# EAGLE schematic Clock (EAGLE 9.6.1)
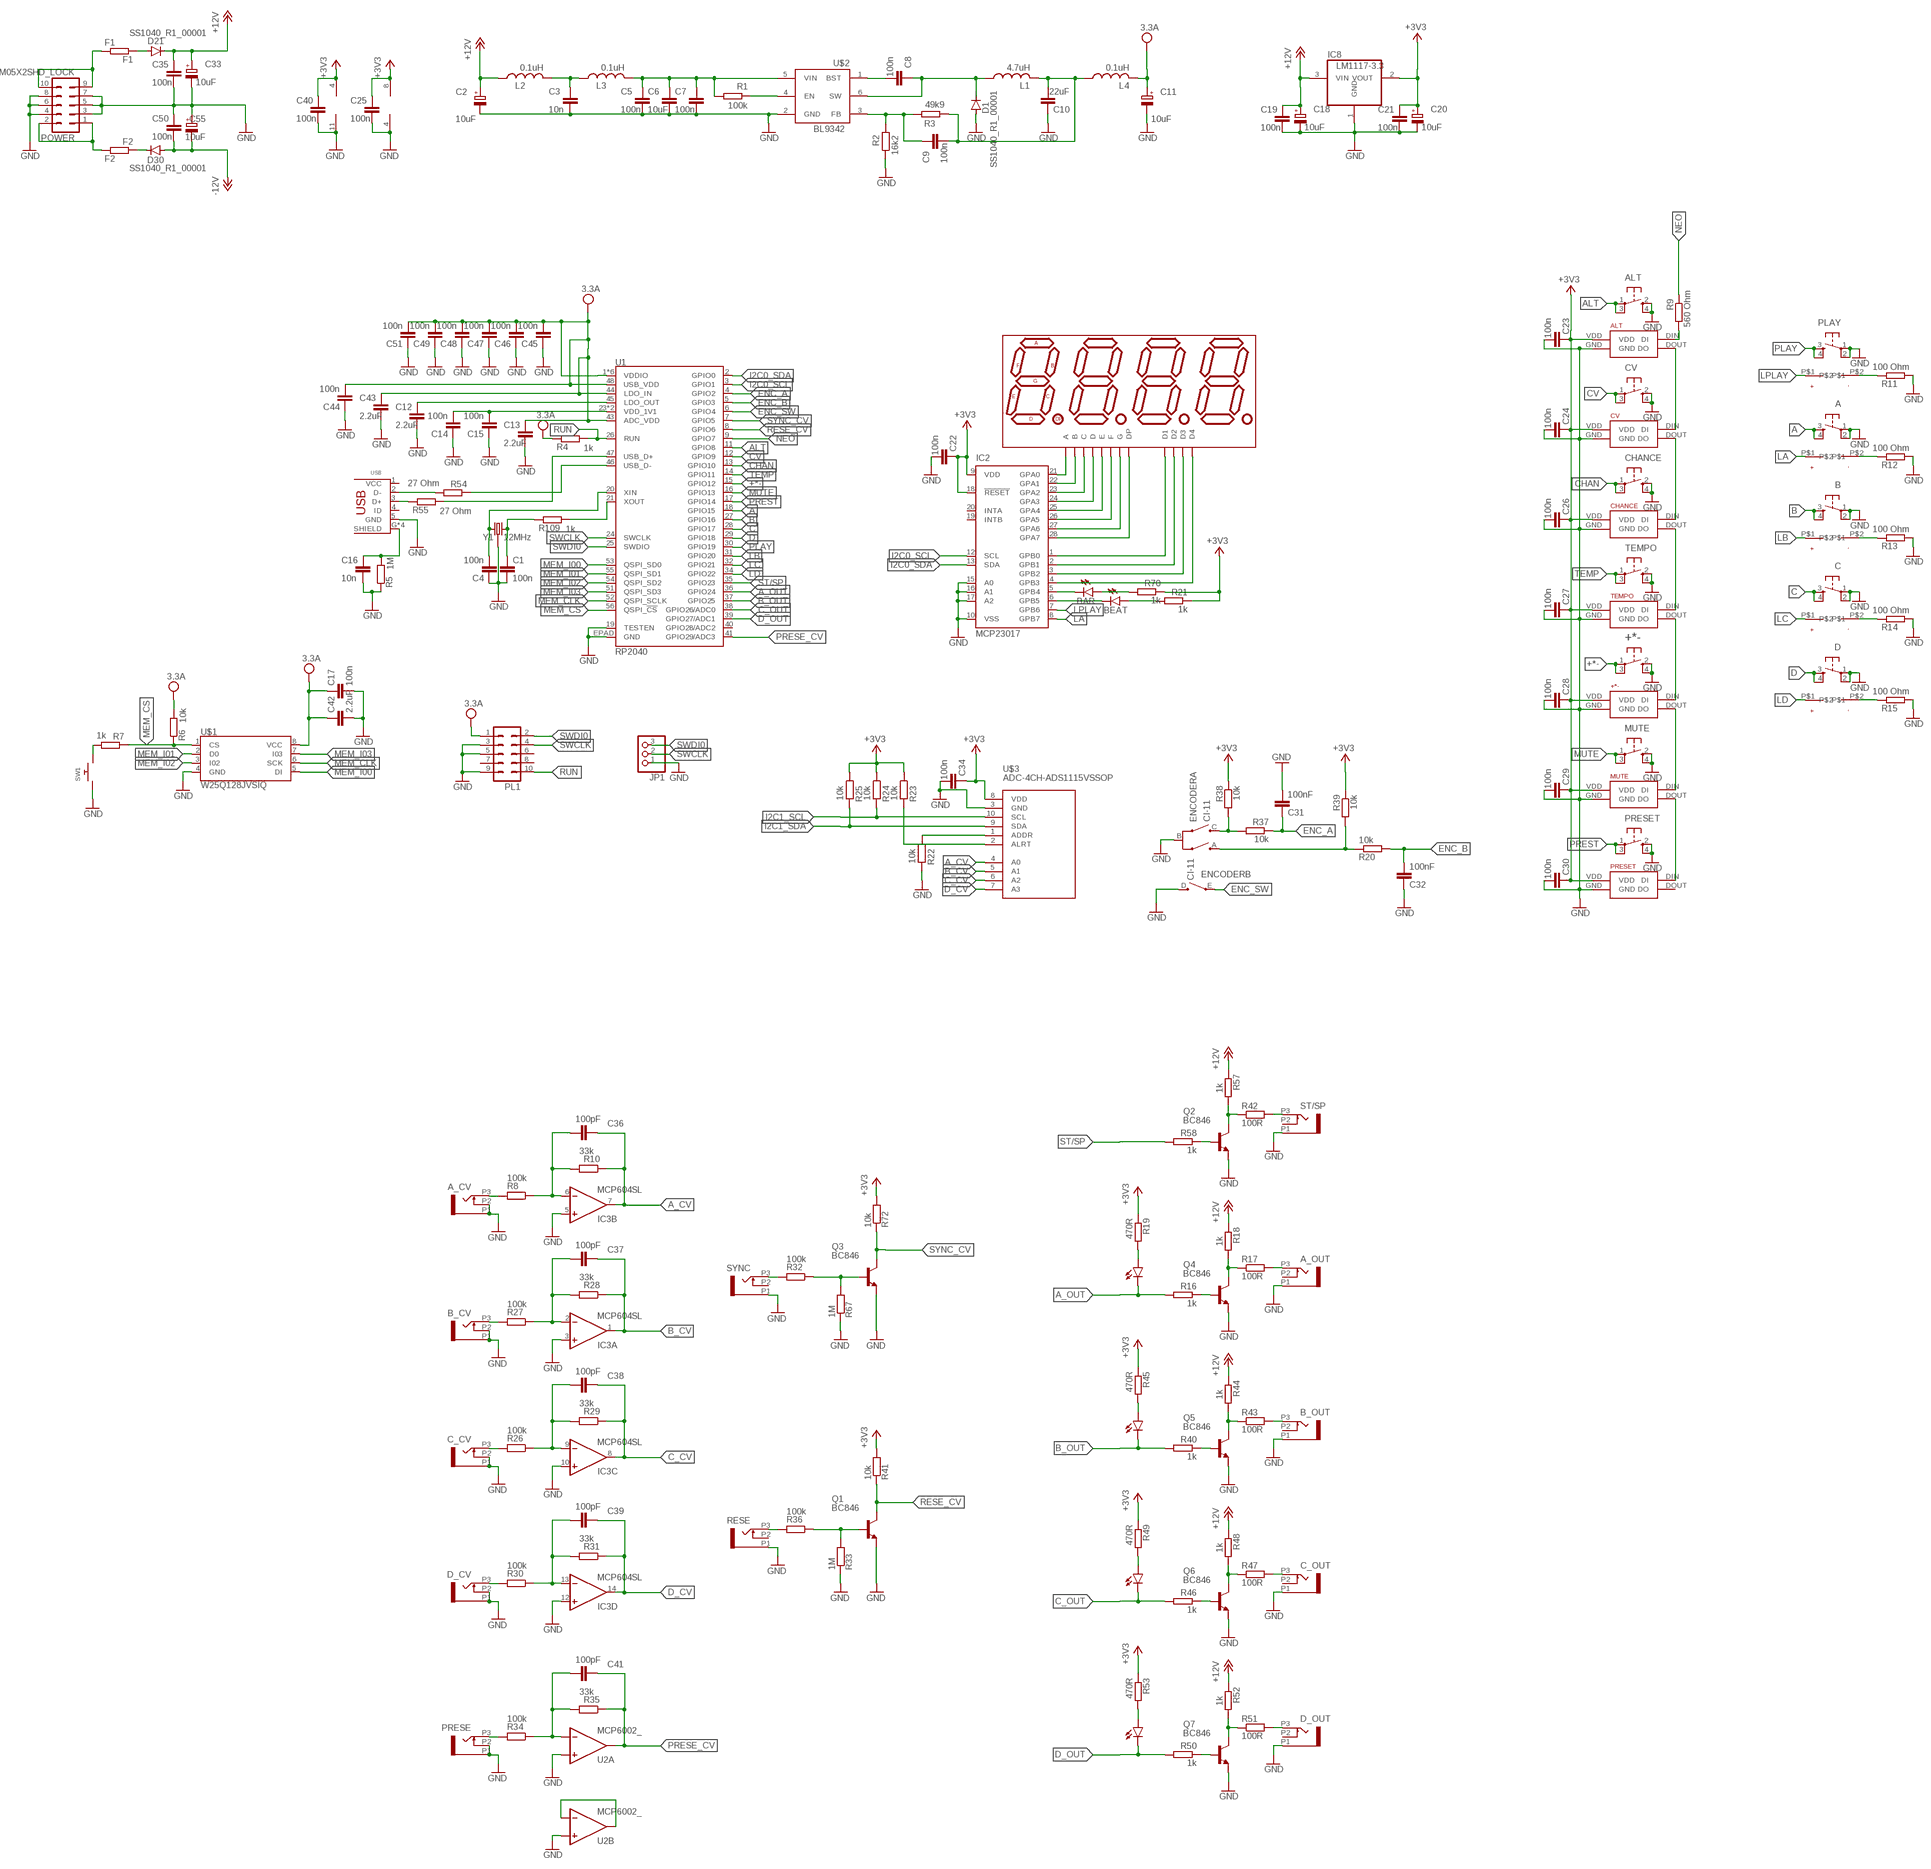
[diagram p0: schematic, sheet 1]

## Parts
+*-  BUTTON_NEOPIXEL  [BUTTON_PIXEL]
A  DTS-6_LEDTME  [TMEBUTTON]
A_CV  OG-PJ301_PJ301_THONKICONNNOHOLER  OG-PJ301_PJ301_THONKICONNNOHOLER_GND_SHORT_PADMINI_GND  [NOHOLER_GND_SHORT_PADMINI_GND]
A_OUT  OG-PJ301_PJ301_THONKICONNNOHOLER  OG-PJ301_PJ301_THONKICONNNOHOLER_GND_SHORT_PADMINI_GND  [NOHOLER_GND_SHORT_PADMINI_GND]
ALT  BUTTON_NEOPIXEL  [BUTTON_PIXEL]
B  DTS-6_LEDTME  [TMEBUTTON]
B_CV  OG-PJ301_PJ301_THONKICONNNOHOLER  OG-PJ301_PJ301_THONKICONNNOHOLER_GND_SHORT_PADMINI_GND  [NOHOLER_GND_SHORT_PADMINI_GND]
B_OUT  OG-PJ301_PJ301_THONKICONNNOHOLER  OG-PJ301_PJ301_THONKICONNNOHOLER_GND_SHORT_PADMINI_GND  [NOHOLER_GND_SHORT_PADMINI_GND]
BAR  2 MM LED  LED3MM  [LED3MM]
BEAT  2 MM LED  LED3MM  [LED3MM]
C  DTS-6_LEDTME  [TMEBUTTON]
C1  100n  C-EUC0603  [C0603]
C2  10uF  CPOL-EUB  [PANASONIC_B]
C3  10n  C-EUC0603  [C0603]
C4  100n  C-EUC0603  [C0603]
C5  100n  C-EUC0603  [C0603]
C6  10uF  C-EUC0603  [C0603]
C7  100n  C-EUC0603  [C0603]
C8  100n  C-EUC0603  [C0603]
C9  100n  C-EUC0603  [C0603]
C10  22uF  C-EUC0603  [C0603]
C11  10uF  CPOL-EUB  [PANASONIC_B]
C12  2.2uF  C-EUC0603  [C0603]
C13  2.2uF  C-EUC0603  [C0603]
C14  100n  C-EUC0603  [C0603]
C15  100n  C-EUC0603  [C0603]
C16  10n  C-EUC0603  [C0603]
C17  100n  C-EUC0603  [C0603]
C18  10uF  CPOL-EUB  [PANASONIC_B]
C19  100n  C-EUC0603  [C0603]
C20  10uF  CPOL-EUB  [PANASONIC_B]
C21  100n  C-EUC0603  [C0603]
C22  100n  C-EUC0603  [C0603]
C23  100n  C-EUC0603  [C0603]
C24  100n  C-EUC0603  [C0603]
C25  100n  C-EUC0603  [C0603]
C26  100n  C-EUC0603  [C0603]
C27  100n  C-EUC0603  [C0603]
C28  100n  C-EUC0603  [C0603]
C29  100n  C-EUC0603  [C0603]
C30  100n  C-EUC0603  [C0603]
C31  100nF  C-EUC0603  [C0603]
C32  100nF  C-EUC0603  [C0603]
C33  10uF  CPOL-EUB  [PANASONIC_B]
C34  100n  C-EUC0603  [C0603]
C35  100n  C-EUC0603  [C0603]
C36  100pF  C-EUC0603  [C0603]
C37  100pF  C-EUC0603  [C0603]
C38  100pF  C-EUC0603  [C0603]
C39  100pF  C-EUC0603  [C0603]
C40  100n  C-EUC0603  [C0603]
C41  100pF  C-EUC0603  [C0603]
C42  2.2uF  C-EUC0603  [C0603]
C43  2.2uF  C-EUC0603  [C0603]
C44  100n  C-EUC0603  [C0603]
C45  100n  C-EUC0603  [C0603]
C46  100n  C-EUC0603  [C0603]
C47  100n  C-EUC0603  [C0603]
C48  100n  C-EUC0603  [C0603]
C49  100n  C-EUC0603  [C0603]
C50  100n  C-EUC0603  [C0603]
C51  100n  C-EUC0603  [C0603]
C55  10uF  CPOL-EUB  [PANASONIC_B]
C_CV  OG-PJ301_PJ301_THONKICONNNOHOLER  OG-PJ301_PJ301_THONKICONNNOHOLER_GND_SHORT_PADMINI_GND  [NOHOLER_GND_SHORT_PADMINI_GND]
C_OUT  OG-PJ301_PJ301_THONKICONNNOHOLER  OG-PJ301_PJ301_THONKICONNNOHOLER_GND_SHORT_PADMINI_GND  [NOHOLER_GND_SHORT_PADMINI_GND]
CHANCE  BUTTON_NEOPIXEL  [BUTTON_PIXEL]
CV  BUTTON_NEOPIXEL  [BUTTON_PIXEL]
D  DTS-6_LEDTME  [TMEBUTTON]
D1  SS1040_R1_00001  DIODE-SOD123  [SOD123]
D21  SS1040_R1_00001  DIODE-SOD123  [SOD123]
D30  SS1040_R1_00001  DIODE-SOD123  [SOD123]
D_CV  OG-PJ301_PJ301_THONKICONNNOHOLER  OG-PJ301_PJ301_THONKICONNNOHOLER_GND_SHORT_PADMINI_GND  [NOHOLER_GND_SHORT_PADMINI_GND]
D_OUT  OG-PJ301_PJ301_THONKICONNNOHOLER  OG-PJ301_PJ301_THONKICONNNOHOLER_GND_SHORT_PADMINI_GND  [NOHOLER_GND_SHORT_PADMINI_GND]
ENCODER  CI-11  [CI-11]
F1  F1  R-EU_R0603  [R0603]
F2  F2  R-EU_R0603  [R0603]
IC2  MCP23017  [SO28]
IC3  MCP604SL  [SO14]
IC8  LM1117-3.3  REG1117  [SOT223]
JP1  PINHD-1X31X3*  [1X3*]
L1  4.7uH  L-USL3225P  [L3225P]
L2  0.1uH  L-USL3225P  [L3225P]
L3  0.1uH  L-USL3225P  [L3225P]
L4  0.1uH  L-USL3225P  [L3225P]
LED_A_OUT  2 MM LED  LED3MM  [LED3MM]
LED_B_OUT  2 MM LED  LED3MM  [LED3MM]
LED_C_OUT  2 MM LED  LED3MM  [LED3MM]
LED_D_OUT  2 MM LED  LED3MM  [LED3MM]
LFD36BUE-101B  7-SEGMENT-4DIGIT-20MM  [7-SEGMENT-4DIGIT-30MM]
MUTE  BUTTON_NEOPIXEL  [BUTTON_PIXEL]
PL1  2X5-1241050  [AMP-1241050-5]
PLAY  DTS-6_LEDTME  [TMEBUTTON]
POWER  M05X2SHD_LOCK  [2X5-SHROUDED_LOCK]
PRESE  OG-PJ301_PJ301_THONKICONNNOHOLER  OG-PJ301_PJ301_THONKICONNNOHOLER_GND_SHORT_PADMINI_GND  [NOHOLER_GND_SHORT_PADMINI_GND]
PRESET  BUTTON_NEOPIXEL  [BUTTON_PIXEL]
Q1  BC846  [SOT23]
Q2  BC846  [SOT23]
Q3  BC846  [SOT23]
Q4  BC846  [SOT23]
Q5  BC846  [SOT23]
Q6  BC846  [SOT23]
Q7  BC846  [SOT23]
R1  100k  R-EU_R0603  [R0603]
R2  16k2  R-EU_R0603  [R0603]
R3  49k9  R-EU_R0603  [R0603]
R4  1k  R-EU_R0603  [R0603]
R5  1M  R-EU_R0603  [R0603]
R6  10k  R-EU_R0603  [R0603]
R7  1k  R-EU_R0603  [R0603]
R8  100k  R-EU_R0603  [R0603]
R9  560 Ohm  R-EU_R0603  [R0603]
R10  33k  R-EU_R0603  [R0603]
R11  100 Ohm  R-EU_R0603  [R0603]
R12  100 Ohm  R-EU_R0603  [R0603]
R13  100 Ohm  R-EU_R0603  [R0603]
R14  100 Ohm  R-EU_R0603  [R0603]
R15  100 Ohm  R-EU_R0603  [R0603]
R16  1k  R-EU_R0603  [R0603]
R17  100R  R-EU_R0603  [R0603]
R18  1k  R-EU_R0603  [R0603]
R19  470R  R-EU_R0603  [R0603]
R20  10k  R-EU_R0603  [R0603]
R21  1k  R-EU_R0603  [R0603]
R22  10k  R-EU_R0603  [R0603]
R23  10k  R-EU_R0603  [R0603]
R24  10k  R-EU_R0603  [R0603]
R25  10k  R-EU_R0603  [R0603]
R26  100k  R-EU_R0603  [R0603]
R27  100k  R-EU_R0603  [R0603]
R28  33k  R-EU_R0603  [R0603]
R29  33k  R-EU_R0603  [R0603]
R30  100k  R-EU_R0603  [R0603]
R31  33k  R-EU_R0603  [R0603]
R32  100k  R-EU_R0603  [R0603]
R33  1M  R-EU_R0603  [R0603]
R34  100k  R-EU_R0603  [R0603]
R35  33k  R-EU_R0603  [R0603]
R36  100k  R-EU_R0603  [R0603]
R37  10k  R-EU_R0603  [R0603]
R38  10k  R-EU_R0603  [R0603]
R39  10k  R-EU_R0603  [R0603]
R40  1k  R-EU_R0603  [R0603]
R41  10k  R-EU_R0603  [R0603]
R42  100R  R-EU_R0603  [R0603]
R43  100R  R-EU_R0603  [R0603]
R44  1k  R-EU_R0603  [R0603]
R45  470R  R-EU_R0603  [R0603]
R46  1k  R-EU_R0603  [R0603]
R47  100R  R-EU_R0603  [R0603]
R48  1k  R-EU_R0603  [R0603]
R49  470R  R-EU_R0603  [R0603]
R50  1k  R-EU_R0603  [R0603]
R51  100R  R-EU_R0603  [R0603]
R52  1k  R-EU_R0603  [R0603]
R53  470R  R-EU_R0603  [R0603]
R54  27 Ohm  R-EU_R0603  [R0603]
R55  27 Ohm  R-EU_R0603  [R0603]
R57  1k  R-EU_R0603  [R0603]
R58  1k  R-EU_R0603  [R0603]
R67  1M  R-EU_R0603  [R0603]
R70  1k  R-EU_R0603  [R0603]
R72  10k  R-EU_R0603  [R0603]
R109  1k  R-EU_R0603  [R0603]
RESE  OG-PJ301_PJ301_THONKICONNNOHOLER  OG-PJ301_PJ301_THONKICONNNOHOLER_GND_SHORT_PADMINI_GND  [NOHOLER_GND_SHORT_PADMINI_GND]
ST/SP  OG-PJ301_PJ301_THONKICONNNOHOLER  OG-PJ301_PJ301_THONKICONNNOHOLER_GND_SHORT_PADMINI_GND  [NOHOLER_GND_SHORT_PADMINI_GND]
SW1  SWITCH_PUSHBUTTONSOFTTOUCHSMD_SJ  [PUSHBUTTON_SMD_SJ]
SYNC  OG-PJ301_PJ301_THONKICONNNOHOLER  OG-PJ301_PJ301_THONKICONNNOHOLER_GND_SHORT_PADMINI_GND  [NOHOLER_GND_SHORT_PADMINI_GND]
TEMPO  BUTTON_NEOPIXEL  [BUTTON_PIXEL]
U1  RP2040  [QFN-56]
U2  MCP6002_  [SO08]
U$1  W25Q128JVSIQ  [SOIC-8]
U$2  BL9342  [SOT23-6]
U$3  ADC-4CH-ADS1115VSSOP  [ADC-4CH-ADS1115-VSSOP]
USB  USB_HRS_ZX62-B-5PA(11)MICRO.B  [HRS_ZX62RD-AB-5P8]
Y1  12MHz  CRYSTAL-25MHZ-WE-SMD-2.0X1.6MM-WE  [CRYSTAL-SMD-2.0X1.6MM-WE]

## Nets
+3V3: +*-.VDD ALT.VDD C20.+ C21.1 C22.1 C23.1 C24.1 C25.1 C26.1 C27.1 C28.1 C29.1 C30.1 C34.1 C40.1 CHANCE.VDD CV.VDD IC2.9(VDD) IC2.18(!RESET) IC3.4(P:V+) IC8.2(VOUT) MUTE.VDD PRESET.VDD R19.1 R21.1 R23.1 R24.1 R25.1 R38.1 R39.1 R41.2 R45.1 R49.1 R53.1 R70.1 R72.2 TEMPO.VDD U2.8(P:V+) U$3.8(VDD)
+12V: C2.+ C18.+ C19.1 C33.+ C35.1 D21.C IC8.3(VIN) L2.1 R18.1 R44.1 R48.1 R52.1 R57.1
+*-: +*-.1 +*-.3 U1.15(GPIO12)
-12V: C50.2 C55.- D30.A
A: A.3 A.4 U1.18(GPIO15)
A_CV: C36.2 IC3.7(B:OUT) R10.1 U$3.4(A0)
A_OUT: LED_A_OUT.K(C) R16.2 U1.36(GPIO24)
ALT: ALT.1 ALT.3 U1.11(GPIO8)
B: B.3 B.4 U1.27(GPIO16)
B_CV: C37.2 IC3.1(A:OUT) R28.1 U$3.5(A1)
B_OUT: LED_B_OUT.K(C) R40.2 U1.37(GPIO25)
C: C.3 C.4 U1.28(GPIO17)
C_CV: C38.2 IC3.8(C:OUT) R29.1 U$3.6(A2)
C_OUT: LED_C_OUT.K(C) R46.2 U1.38(GPIO26/ADC0)
CHAN: CHANCE.1 CHANCE.3 U1.13(GPIO10)
CV: CV.1 CV.3 U1.12(GPIO9)
D: D.3 D.4 U1.29(GPIO18)
D_CV: C39.2 IC3.14(D:OUT) R31.1 U$3.7(A3)
D_OUT: LED_D_OUT.K(C) R50.2 U1.39(GPIO27/ADC1)
ENC_A: C31.1 R37.1 U1.4(GPIO2)
ENC_B: C32.2 R20.2 U1.5(GPIO3)
ENC_SW: ENCODER.E(B:E) U1.6(GPIO4)
GND: +*-.2 +*-.4 +*-.GND A.1 A.2 A_CV.P1 A_CV.P2 A_OUT.P1 ALT.2 ALT.4 ALT.GND B.1 B.2 B_CV.P1 B_CV.P2 B_OUT.P1 C1.2 C2.- C3.2 C4.1 C5.2 C6.2 C7.2 C10.1 C11.- C12.2 C13.2 C14.1 C15.1 C16.2 C17.2 C18.- C19.2 C20.- C21.2 C22.2 C23.2 C24.2 C25.2 C26.2 C27.2 C28.2 C29.2 C30.2 C31.2 C32.1 C33.- C34.2 C35.2 C40.2 C42.2 C43.2 C44.1 C45.1 C46.1 C47.1 C48.1 C49.1 C50.1 C51.1 C55.+ C.1 C.2 C_CV.P1 C_CV.P2 C_OUT.P1 CHANCE.2 CHANCE.4 CHANCE.GND CV.2 CV.4 CV.GND D1.A D.1 D.2 D_CV.P1 D_CV.P2 D_OUT.P1 ENCODER.B(A:C) ENCODER.D(B:D) IC2.10(VSS) IC2.15(A0) IC2.16(A1) IC2.17(A2) IC3.3(A:+IN) IC3.5(B:+IN) IC3.10(C:+IN) IC3.11(P:V-) IC3.12(D:+IN) IC8.1(GND) JP1.1 MUTE.2 MUTE.4 MUTE.GND PL1.3 PL1.5 PL1.9 PLAY.1 PLAY.2 POWER.3 POWER.4 POWER.5 POWER.6 POWER.7 POWER.8 PRESE.P1 PRESE.P2 PRESET.2 PRESET.4 PRESET.GND Q1.2(E) Q2.2(E) Q3.2(E) Q4.2(E) Q5.2(E) Q6.2(E) Q7.2(E) R2.1 R5.1 R11.2 R12.2 R13.2 R14.2 R15.2 R22.2 R33.1 R67.1 RESE.P1 ST/SP.P1 SW1.P$1 SYNC.P1 TEMPO.2 TEMPO.4 TEMPO.GND U1.19(TESTEN) U1.EPAD(GND) U2.3(A:+IN) U2.4(P:V-) U2.5(B:+IN) U$1.4(GND) U$2.2(GND) U$3.3(GND) USB.5(GND) Y1.2(GND) Y1.4(GND)
I2C0_SCL: IC2.12(SCL) U1.3(GPIO1)
I2C0_SDA: IC2.13(SDA) U1.2(GPIO0)
I2C1_SCL: R24.2 U$3.10(SCL)
I2C1_SDA: R25.2 U$3.9(SDA)
LA: A.P$1 IC2.8(GPB7)
LB: B.P$1 U1.31(GPIO20)
LC: C.P$1 U1.32(GPIO21)
LD: D.P$1 U1.34(GPIO22)
LPLAY: IC2.7(GPB6) PLAY.P$1
MEM_CLK: U1.52(QSPI_SCLK) U$1.6(SCK)
MEM_CS: R6.1 R7.1 U1.56(QSPI_!CS!) U$1.1(CS)
MEM_I00: U1.53(QSPI_SD0) U$1.5(DI)
MEM_I01: U1.55(QSPI_SD1) U$1.2(D0)
MEM_I02: U1.54(QSPI_SD2) U$1.3(I02)
MEM_I03: U1.51(QSPI_SD3) U$1.7(I03)
MUTE: MUTE.1 MUTE.3 U1.16(GPIO13)
N$1: R109.2 U1.21(XOUT)
N$2: C4.2 U1.20(XIN) Y1.1
N$3: C1.1 R109.1 Y1.3
N$4: R1.2 U$2.4(EN)
N$5: C5.1 C6.1 C7.1 L3.2 R1.1 U$2.5(VIN)
N$6: C3.1 L2.2 L3.1
N$7: C8.2 U$2.1(BST)
N$8: C8.1 D1.C L1.1 U$2.6(SW)
N$9: C9.1 R2.2 R3.2 U$2.3(FB)
N$10: C9.2 C10.2 L1.2 L4.1 R3.1
N$11: IC2.21(GPA0) LFD36BUE-101B.11(A)
N$12: R55.2 U1.47(USB_D+)
N$14: R54.1 U1.46(USB_D-)
N$15: C16.1 R5.2 USB.G2(SHIELD) USB.G3(SHIELD) USB.G4(SHIELD) USB.G(SHIELD)
N$16: IC2.22(GPA1) LFD36BUE-101B.7(B)
N$17: R7.2 SW1.P$2
N$18: IC2.23(GPA2) LFD36BUE-101B.4(C)
N$19: IC2.24(GPA3) LFD36BUE-101B.2(D)
N$20: IC2.25(GPA4) LFD36BUE-101B.1(E)
N$21: IC2.26(GPA5) LFD36BUE-101B.10(F)
N$22: IC2.27(GPA6) LFD36BUE-101B.5(G)
N$23: IC2.28(GPA7) LFD36BUE-101B.3(DP)
N$24: IC2.1(GPB0) LFD36BUE-101B.12(D1)
N$25: IC2.2(GPB1) LFD36BUE-101B.9(D2)
N$26: IC2.3(GPB2) LFD36BUE-101B.8(D3)
N$27: IC2.4(GPB3) LFD36BUE-101B.6(D4)
N$28: C36.1 IC3.6(B:-IN) R8.1 R10.2
N$29: ALT.DIN(DI) R9.2
N$30: ALT.DOUT(DO) CV.DIN(DI)
N$31: CHANCE.DIN(DI) CV.DOUT(DO)
N$32: CHANCE.DOUT(DO) TEMPO.DIN(DI)
N$33: +*-.DIN(DI) TEMPO.DOUT(DO)
N$34: +*-.DOUT(DO) MUTE.DIN(DI)
N$35: MUTE.DOUT(DO) PRESET.DIN(DI)
N$36: U2.6(B:-IN) U2.7(B:OUT)
N$37: C37.1 IC3.2(A:-IN) R27.1 R28.2
N$38: C38.1 IC3.9(C:-IN) R26.1 R29.2
N$39: C39.1 IC3.13(D:-IN) R30.1 R31.2
N$40: PLAY.P$2 R11.1
N$41: A.P$2 R12.1
N$42: B.P$2 R13.1
N$43: F1.2 POWER.9 POWER.10
N$44: D21.A F1.1
N$45: F2.2 POWER.1 POWER.2
N$46: D30.C F2.1
N$47: C.P$2 R14.1
N$48: D.P$2 R15.1
N$49: A_OUT.P3 R17.2
N$50: B_OUT.P3 R43.2
N$51: Q3.1(B) R32.1 R67.2
N$52: C_OUT.P3 R47.2
N$53: Q1.1(B) R33.2 R36.1
N$54: D_OUT.P3 R51.2
N$55: Q2.1(B) R58.1
N$56: A_CV.P3 R8.2
N$57: B_CV.P3 R27.2
N$58: C_CV.P3 R26.2
N$59: D_CV.P3 R30.2
N$60: R42.2 ST/SP.P3
N$61: Q2.3(C) R42.1 R57.2
N$62: R32.2 SYNC.P3
N$63: PRESE.P3 R34.2
N$64: R36.2 RESE.P3
N$65: ENCODER.A(A:A) R20.1 R39.2
N$66: ENCODER.C(A:B) R37.2 R38.2
N$67: BAR.A R70.2
N$68: BEAT.A R21.2
N$69: BAR.K(C) IC2.5(GPB4)
N$70: BEAT.K(C) IC2.6(GPB5)
N$71: R55.1 USB.3(D+)
N$72: C41.1 R34.1 R35.2 U2.2(A:-IN)
N$73: R22.1 U$3.1(ADDR)
N$74: R23.2 U$3.2(ALRT)
N$75: Q4.1(B) R16.1
N$76: Q4.3(C) R17.1 R18.2
N$77: LED_A_OUT.A R19.2
N$78: R54.2 USB.2(D-)
N$79: Q5.1(B) R40.1
N$80: Q5.3(C) R43.1 R44.2
N$81: LED_B_OUT.A R45.2
N$83: Q6.1(B) R46.1
N$84: Q6.3(C) R47.1 R48.2
N$85: LED_C_OUT.A R49.2
N$86: C14.2 C15.2 U1.23(VDD_1V1) U1.50(VDD_1V1)
N$87: Q7.1(B) R50.1
N$88: Q7.3(C) R51.1 R52.2
N$89: LED_D_OUT.A R53.2
N$90: C12.1 U1.45(LDO_OUT)
NEO: R9.1 U1.9(GPIO7)
PLAY: PLAY.3 PLAY.4 U1.30(GPIO19)
PRESE_CV: C41.2 R35.1 U1.41(GPIO29/ADC3) U2.1(A:OUT)
PREST: PRESET.1 PRESET.3 U1.17(GPIO14)
RESE_CV: Q1.3(C) R41.1 U1.8(GPIO6)
RUN: PL1.10 R4.2 U1.26(RUN)
ST/SP: R58.2 U1.35(GPIO23)
SWCLK: JP1.2 PL1.4 U1.24(SWCLK)
SWDI0: JP1.3 PL1.2 U1.25(SWDIO)
SYNC_CV: Q3.3(C) R72.1 U1.7(GPIO5)
TEMP: TEMPO.1 TEMPO.3 U1.14(GPIO11)
VCC: C11.+ C13.1 C17.1 C42.1 C43.1 C44.2 C45.2 C46.2 C47.2 C48.2 C49.2 C51.2 L4.2 PL1.1 R4.1 R6.2 U1.1(VDDIO) U1.10(VDDIO) U1.22(VDDIO) U1.33(VDDIO) U1.42(VDDIO) U1.43(ADC_VDD) U1.44(LDO_IN) U1.48(USB_VDD) U1.49(VDDIO) U$1.8(VCC) ; supply symbol labelled 3.3A
Unconnected: A_OUT.P2 B_OUT.P2 C_OUT.P2 D_OUT.P2 IC2.19(INTB) IC2.20(INTA) PL1.6 PL1.7 PL1.8 PRESET.DOUT(DO) RESE.P2 ST/SP.P2 SYNC.P2 U1.40(GPIO28/ADC2) USB.1(VCC) USB.4(ID)

## Library data of the parts
+*- ALT CHANCE CV MUTE PRESET TEMPO = switch-tact:BUTTON_NEOPIXEL
A B C D PLAY = switch-tact:DTS-6_LED
A_CV A_OUT B_CV B_OUT C_CV C_OUT D_CV D_OUT PRESE RESE ST/SP SYNC = Thonkikonn:OG-PJ301_PJ301_THONKICONN
BAR BEAT LED_A_OUT LED_B_OUT LED_C_OUT LED_D_OUT = led:LED: LED OSRAM: - CHIPLED LG R971, LG N971, LY N971, LG Q971, LY Q971, LO R971, LY R971 LH N974, LH R974 LS Q976, LO Q976, LY Q976 LO Q996 - Hyper CHIPLED LW Q18S LB Q993, LB Q99A, LB R99A - SideLED LS A670, LO A670, LY A670, LG A670, LP A670 LB A673, LV A673, LT A673, LW A673 LH A674 LY A675 LS A676, LA A676, LO A676, LY A676, LW A676 LS A679, LY A679, LG A679 - Hyper Micro SIDELED® LS Y876, LA Y876, LO Y876, LY Y876 LT Y87S - SmartLED LW L88C, LW L88S LB L89C, LB L89S, LG L890 LS L89K, LO L89K, LY L89K LS L896, LA L896, LO L896, LY L896 - TOPLED LS T670, LO T670, LY T670, LG T670, LP T670 LSG T670, LSP T670, LSY T670, LOP T670, LYG T670 LG T671, LOG T671, LSG T671 LB T673, LV T673, LT T673, LW T673 LH T674 LS T676, LA T676, LO T676, LY T676, LB T676, LH T676, LSB T676, LW T676 LB T67C, LV T67C, LT T67C, LS T67K, LO T67K, LY T67K, LW E67C LS E67B, LA E67B, LO E67B, LY E67B, LB E67C, LV E67C, LT E67C LW T67C LS T679, LY T679, LG T679 LS T770, LO T770, LY T770, LG T770, LP T770 LB T773, LV T773, LT T773, LW T773 LH T774 LS E675, LA E675, LY E675, LS T675 LS T776, LA T776, LO T776, LY T776, LB T776 LHGB T686 LT T68C, LB T68C - Hyper Mini TOPLED® LB M676 - Mini TOPLED Santana® LG M470 LS M47K, LO M47K, LY M47K Source: http://www.osram.convergy.de LUXEON: - LUMILED® LXK2-PW12-R00, LXK2-PW12-S00, LXK2-PW14-U00, LXK2-PW14-V00 LXK2-PM12-R00, LXK2-PM12-S00, LXK2-PM14-U00 LXK2-PE12-Q00, LXK2-PE12-R00, LXK2-PE12-S00, LXK2-PE14-T00, LXK2-PE14-U00 LXK2-PB12-K00, LXK2-PB12-L00, LXK2-PB12-M00, LXK2-PB14-N00, LXK2-PB14-P00, LXK2-PB14-Q00 LXK2-PR12-L00, LXK2-PR12-M00, LXK2-PR14-Q00, LXK2-PR14-R00 LXK2-PD12-Q00, LXK2-PD12-R00, LXK2-PD12-S00 LXK2-PH12-R00, LXK2-PH12-S00 LXK2-PL12-P00, LXK2-PL12-Q00, LXK2-PL12-R00 Source: www.luxeon.com KINGBRIGHT: KA-3528ASYC Source: www.kingbright.com
C1 C3-C10 C12-C17 C19 C21-C30 C34 C35 C40 C42-C51 = rcl:C-EU: CAPACITOR, European symbol
C2 C11 C18 C20 C33 C55 = rcl:CPOL-EU: POLARIZED CAPACITOR, European symbol
C31 C32 C36-C39 C41 = rcl:C-EU: CAPACITOR, European symbol; SPICEPREFIX: C
D1 D21 D30 = diode:DIODE-: DIODE
ENCODER = piher:CI-11: 11mm Incemental Encoder Source: www.piher.net .. 04-CI-11v04.pdf
F1 F2 R1-R19 R21-R36 R40-R55 R57 R58 R67 R70 R72 R109 = rcl:R-EU_: RESISTOR, European symbol
IC2 = adafruit:MCP23017: http://ww1.microchip.com/downloads/en/DeviceDoc/21952a.pdf Source: http://ww1.microchip.com/downloads/en/DeviceDoc/21952a.pdf
IC3 = linear:MCP604: Quad Op Amp 2.7V to 6.0V Single Supply CMOS Source: http://ww1.microchip.com/downloads/en/DeviceDoc/21314g.pdf
IC8 = og-vreg:REG1117: 800mA and 1A Low Dropout (LDO) Positive Regulator 1.8V, 2.5V, 2.85V, 3.3V, 5V, and Adj
JP1 = pinhead:PINHD-1X3: PIN HEADER
L1-L4 = rcl:L-US: INDUCTOR, American symbol
LFD36BUE-101B = SparkFun-LED:7-SEGMENT-4DIGIT-20MM: 4 Digit 7 Segment Display This is a part for the 4-Digit 7-segment LEDs from Young Sun. Different from the Digikey LEDs, all 16 pins are used. The LONGPADS Variant is used for a test jig, but you may like it because there is more pad to solder to. If you are concerned about routing space, the standard works just fine though. Datasheets: Red <http://cdn.sparkfun.com/datasheets/Components/LED/1LEDREDCC.pdf> Yellow <http://cdn.sparkfun.com/datasheets/Components/LED/1LEDYELCC.pdf> Green <http://cdn.sparkfun.com/datasheets/Components/LED/1LEDGRNCC.pdf> Blue <http://cdn.sparkfun.com/datasheets/Components/LED/1LEDBLUCC.pdf> White <http://cdn.sparkfun.com/datasheets/Components/LED/1LEDWHTCC.pdf> SparkFun Products Raw Components 7-Segment Display - 20mm (Red) <https://www.sparkfun.com/products/11405> (COM-11405) 7-Segment Display - 20mm (Yellow) <https://www.sparkfun.com/products/11406> (COM-11406) 7-Segment Display - 20mm (Green) <https://www.sparkfun.com/products/11407> (COM-11407) 7-Segment Display - 20mm (Blue) <https://www.sparkfun.com/products/11408> (COM-11408) 7-Segment Display - 20mm (White) <https://www.sparkfun.com/products/11409> (COM-11409) Serial Controlled SparkFun OpenSegment Serial Display - 20mm (Red) <https://www.sparkfun.com/products/11644> (COM-11644) SparkFun OpenSegment Serial Display - 20mm (Yellow) <https://www.sparkfun.com/products/11645> (COM-11645) SparkFun OpenSegment Serial Display - 20mm (Green) <https://www.sparkfun.com/products/11646> (COM-11646) SparkFun OpenSegment Serial Display - 20mm (Blue) <https://www.sparkfun.com/products/11647> (COM-11647) SparkFun OpenSegment Serial Display - 20mm (White) <https://www.sparkfun.com/products/11648> (COM-11648) Other SparkFun OpenSegment Shield <https://www.sparkfun.com/products/13190> (DEV-13190)
PL1 = jt-con-tyco:2X5-*
POWER = SparkFun:M05X2: Header 5x2 Standard 10-pin dual row 0.1" header. Commonly used with AVR-ISP. Use with Spark Fun Electronics SKU: PRT-00778
Q1-Q7 = transistor:BC846: NPN TRANSISTOR
R20 R37-R39 = rcl:R-EU_: RESISTOR, European symbol; SPICEPREFIX: R
SW1 = adafruit:SWITCH_PUSHBUTTON: Buttons SOFTTOUCHSMD_SJ - Soft touch temporary push button (Super Junk Akihabara) Compatible with SKPMANE010 [Mouser: 688-SKPMAN] C&K_KSS = Digikey: KSS221GLFS
U1 = SparkFun-IC-Microcontroller:RP2040: Raspberry Pi RP2040 MCU 56-pin 32-bit Microcontroller with 264kB of SRAM and external flash support up to 16MB Getting Started with the RP2040 <https://pico.raspberrypi.org/getting-started/> Dual-core ARM Cortex M0+ processor, flexible clock running up to 133 MHz 264kB of SRAM, and QSPI control of common flash memory USB 1.1 Host and Device support Low-power sleep and dormant modes Drag & drop programming using mass storage over USB 26 multi-function GPIO pins 2×SPI, 2×I2C, 2×UART, 3×12-bit ADC, 16×controllable PWM channels Accurate clock and timer on-chip Temperature sensor Accelerated floating point libraries on-chip 8×Programmable IO (PIO) state machines for custom peripheral support; PROD_ID: IC-15502
U2 = MTM:MCP6002: Generic Dual Op Amp
U$1 = SparkFun-IC-Memory:W25Q128JVSIQ
U$2 = adafruit:BL9342
U$3 = diy-modules:ADC-4CH-ADS1115: 4 Channel 16-Bit Analog-to-Digital Converter based on ADS1115 chip Arduino ADS1115 Getting Started Tutorial is available here: http://henrysbench.capnfatz.com/henrys-bench/arduino-voltage-measurements/arduino-ads1115-module-getting-started-tutorial/ ADS1115 datasheet is available here: http://www.ti.com/lit/ds/symlink/ads1115.pdf Click here to find device on ebay.com <http://www.ebay.com/sch/ads1115+module>
USB = Rebel:USB_HRS_ZX62-B-5PA(11)MICRO.B
Y1 = SparkFun-Clocks:CRYSTAL-25MHZ-WE: 25MHz Crystal; PROD_ID: XTAL-16515; VALUE: 25MHz